# Altium project CurrentMonitorAndController.PrjPcb (part 2 of 2)

## Sheet Display.SchDoc
size A4
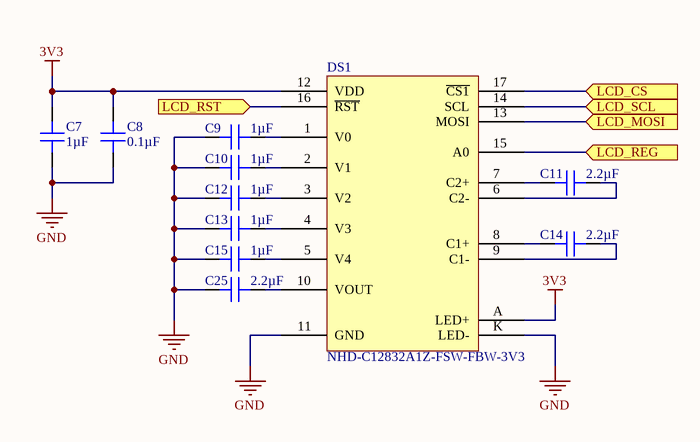
[diagram p4: Display.SchDoc]

### Parts
C7  1µF  [CAP 0603_1608]
C8  0.1µF  [CAP 0603_1608]
C9  1µF  [CAP 0603_1608]
C10  1µF  [CAP 0603_1608]
C11  2.2µF  [CAP 0603_1608]
C12  1µF  [CAP 0603_1608]
C13  1µF  [CAP 0603_1608]
C14  2.2µF  [CAP 0603_1608]
C15  1µF  [CAP 0603_1608]
C25  2.2µF  [CAP 0603_1608]
DS1  NHD-C12832A1Z-FSW-FBW-3V3  [NHD-C12832A1Z WHITE]

### Ports
LCD_CS (in), LCD_MOSI (in), LCD_REG (in), LCD_RST (in), LCD_SCL (in)

### Nets
3V3: C7.2 C8.2 DS1.12(VDD) DS1.A(LED+)
GND: C7.1 C8.1 C9.2 C10.2 C12.2 C13.2 C15.2 C25.1 DS1.11(GND) DS1.K(LED-)
LCD_CS: DS1.17(~{CS1}) ; port LCD_CS
LCD_REG: DS1.15(A0) ; port LCD_REG
LCD_RST: DS1.16(~{RST}) ; port LCD_RST
SCL: DS1.14(SCL) ; port LCD_SCL
SPI_MOSI: DS1.13(MOSI) ; port LCD_MOSI
NetC9_1: C9.1 DS1.1(V0)
NetC10_1: C10.1 DS1.2(V1)
NetC11_1: C11.1 DS1.7(C2+)
NetC11_2: C11.2 DS1.6(C2-)
NetC12_1: C12.1 DS1.3(V2)
NetC13_1: C13.1 DS1.4(V3)
NetC14_1: C14.1 DS1.8(C1+)
NetC14_2: C14.2 DS1.9(C1-)
NetC15_1: C15.1 DS1.5(V4)
NetC25_2: C25.2 DS1.10(VOUT)

### Notes on the sheet
- Title
- Size:
- Date:
- A4
- Number:
- Time:
- Revision:
- Sheet
- of
- File:

### Library data of the parts
C7 C9 C10 C12 C13 C15 = TMK107BJ105MAHT: CAP CER 1UF 25V X5R 0603; Manufacturer: Taiyo Yuden; Tolerance: ±20%; Part Number: TMK107BJ105MAHT; Value: 1µF; Applications: Automotive, SMPS Filtering; Capacitance: 1µF; ComponentLink1Description: Datasheet; ComponentLink1URL: https://ds.yuden.co.jp/TYCOMPAS/ut/detail?pn=TMK107BJ105MAHT &u=M; ComponentLink2Description: DigiKey Link; ComponentLink2URL: http://digikey.com/product-detail/en/taiyo-yuden/TMK107BJ105MAHT/587-6356-1-ND/9949942; Device Package: 0603 (1608 Metric); Features: Ultra Low ESR; LastUpdated: 02/01/2020 00:02:07; Lifecycle Status: Active; Minimum Order: 1; Mounting Type: Surface Mount, MLCC; Operating Temperature: -55°C ~ 85°C; Package / Case: 0603 (1608 Metric); Packaging: ReReel; PartId: 2797; Part Status: Active; Price: 0.00; Ratings: AEC-Q200; Series: M; Size / Dimension: 0.063" L x 0.031" W (1.60mm x 0.80mm); Supplier 1: DigiKey; Supplier Part Number 1: 587-6356-1-ND; Temperature Coefficient: X5R; Thickness (Max): 0.035" (0.90mm); Voltage - Rated: 25V
C8 = CS0603KRX7R7BB104: CAP CER 0.1UF 16V X7R 0603; Manufacturer: Yageo; Tolerance: ±10%; Part Number: CS0603KRX7R7BB104; Value: 0.1µF; Applications: Boardflex Sensitive; Capacitance: 0.1µF; ComponentLink1Description: Datasheet; ComponentLink1URL: http://www.yageo.com/NewPortal/yageodocoutput?fileName=/pdf/MLCC/UPY-ST_NPOX7R_16V-to-3KV_5.pdf; ComponentLink2Description: DigiKey Link; ComponentLink2URL: http://digikey.com/product-detail/en/yageo/CS0603KRX7R7BB104/311-3560-1-ND/7648487; Device Package: 0603 (1608 Metric); Features: Soft Termination; LastUpdated: 02/01/2020 00:02:08; Lifecycle Status: Active; Minimum Order: 1; Mounting Type: Surface Mount, MLCC; Operating Temperature: -55°C ~ 125°C; Package / Case: 0603 (1608 Metric); Packaging: ReReel; PartId: 2286; Part Status: Active; Price: 0.00; Series: CS; Size / Dimension: 0.063" L x 0.031" W (1.60mm x 0.80mm); Supplier 1: DigiKey; Supplier Part Number 1: 311-3560-1-ND; Temperature Coefficient: X7R; Thickness (Max): 0.037" (0.95mm); Voltage - Rated: 16V
C11 C14 C25 = CC0603ZRY5V7BB225: CAP CER 2.2UF 16V Y5V 0603; Manufacturer: Yageo; Temperature Coefficient: Y5V (F); Tolerance: -20%, +80%; Part Number: CC0603ZRY5V7BB225; Value: 2.2µF; Applications: General Purpose; Capacitance: 2.2µF; ComponentLink1Description: Datasheet; ComponentLink1URL: http://www.yageo.com/documents/recent/UPY-GPHC_Y5V_6.3V-to-50V_8.pdf; ComponentLink2Description: DigiKey Link; ComponentLink2URL: http://digikey.com/product-detail/en/yageo/CC0603ZRY5V7BB225/311-3416-1-ND/7164437; Device Package: 0603 (1608 Metric); LastUpdated: 21/01/2020 00:02:09; Lifecycle Status: Active; Minimum Order: 1; Mounting Type: Surface Mount, MLCC; Operating Temperature: -30°C ~ 85°C; Package / Case: 0603 (1608 Metric); Packaging: TapeAndReel; PartId: 2203; Part Status: Active; Price: 0.02; Series: CC; Size / Dimension: 0.063" L x 0.031" W (1.60mm x 0.80mm); Supplier 1: DigiKey; Supplier Part Number 1: 311-3416-1-ND; Thickness (Max): 0.035" (0.90mm); Voltage - Rated: 16V
DS1 = NHD-C12832A1Z-FSW-FBW-3V3: LCD COG GRAPHIC 128X32; Manufacturer: Newhaven Display Intl; Background Color: White (Black - Inverted); Backlight: LED - White; Display Mode: Transflective; Display Type: FSTN - Film Super-Twisted Nematic; Interface: SPI; Viewing Area: 36.00mm W x 12.00mm H; Part Number: NHD-C12832A1Z-FSW-FBW-3V3; ComponentLink1Description: Datasheet; ComponentLink1URL: http://www.newhavendisplay.com/specs/NHD-C12832A1Z-FSW-FBW-3V3.pdf; ComponentLink2Description: DigiKey Link; ComponentLink2URL: //digikey.com/product-detail/en/newhaven-display-intl/NHD-C12832A1Z-FSW-FBW-3V3/NHD-C12832A1Z-FSW-FBW-3V3-ND/2059236; LastUpdated: 04/12/2019 12:49:03; Lifecycle Status: 0; Minimum Order: 1; Packaging: Unknown; PartId: 1; Part Status: Active; Price: 11.53; Series: -; Supplier 1: DigiKey; Supplier Part Number 1: NHD-C12832A1Z-FSW-FBW-3V3-ND

## Sheet Regulator3V3.SchDoc: 3V3 Regulator
size A4
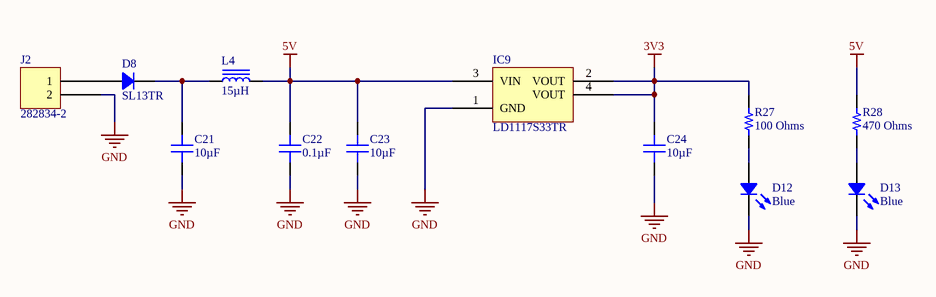
[diagram p5: Regulator3V3.SchDoc]

### Parts
C21  10µF  [CAP 1206_3216 - 1.8MM]
C22  0.1µF  [CAP 0603_1608]
C23  10µF  [CAP 1206_3216 - 1.8MM]
C24  10µF  [CAP 1206_3216 - 1.8MM]
D8  SL13TR  [DO214AC SMA]
D12  Blue  [LED 0603_1608 BLUE]
D13  Blue  [LED 0603_1608 BLUE]
IC9  LD1117S33TR  [ST SOT-223]
J2  282834-2  [TE 282834-2]
L4  15µH  [TDK VLCF4024-2]
R27  100 Ohms  [RES 0603_1608]
R28  470 Ohms  [RES 0603_1608]

### Nets
3V3: C24.2 IC9.2(VOUT) IC9.4(VOUT) R27.2
5V: C22.2 C23.2 IC9.3(VIN) L4.2 R28.2
GND: C21.1 C22.1 C23.1 C24.1 D12.2 D13.2 IC9.1(GND) J2.2
NetC21_2: C21.2 D8.2 L4.1
NetD8_1: D8.1 J2.1
NetD12_1: D12.1 R27.1
NetD13_1: D13.1 R28.1

### Notes on the sheet
- Title
- Size:
- Date:
- A4
- Number:
- Time:
- Revision:
- Sheet
- of
- File:

### Library data of the parts
C21 C23 C24 = CL31A106KPHNNNE: CAP CER 10UF 10V X5R 1206; Manufacturer: Samsung Electro-Mechanics; Tolerance: ±10%; Part Number: CL31A106KPHNNNE; Value: 10µF; Applications: General Purpose; Capacitance: 10µF; ComponentLink1Description: Datasheet; ComponentLink1URL: http://www.samsungsem.com/kr/support/product-search/mlcc/CL31A106KPHNNNE.jsp; ComponentLink2Description: DigiKey Link; ComponentLink2URL: http://digikey.com/product-detail/en/samsung-electro-mechanics/CL31A106KPHNNNE/1276-1148-1-ND/3889234; Device Package: 1206 (3216 Metric); LastUpdated: 21/01/2020 00:03:41; Lifecycle Status: Active; Minimum Order: 1; Mounting Type: Surface Mount, MLCC; Operating Temperature: -55°C ~ 85°C; Package / Case: 1206 (3216 Metric); Packaging: TapeAndReel; PartId: 21985; Part Status: Active; Price: 0.04; Series: CL; Size / Dimension: 0.126" L x 0.063" W (3.20mm x 1.60mm); Supplier 1: DigiKey; Supplier Part Number 1: 1276-1148-1-ND; Temperature Coefficient: X5R; Thickness (Max): 0.071" (1.80mm); Voltage - Rated: 10V
C22 = CS0603KRX7R7BB104: as C8 on sheet Display; Part Number: CS0603KRX7R7BB104; Value: 0.1µF; Applications: Boardflex Sensitive; Capacitance: 0.1µF; ComponentLink1Description: Datasheet; ComponentLink1URL: http://www.yageo.com/NewPortal/yageodocoutput?fileName=/pdf/MLCC/UPY-ST_NPOX7R_16V-to-3KV_5.pdf; ComponentLink2Description: DigiKey Link; ComponentLink2URL: http://digikey.com/product-detail/en/yageo/CS0603KRX7R7BB104/311-3560-1-ND/7648487; Device Package: 0603 (1608 Metric); Features: Soft Termination; LastUpdated: 02/01/2020 00:02:08; Lifecycle Status: Active; Minimum Order: 1; Mounting Type: Surface Mount, MLCC; Operating Temperature: -55°C ~ 125°C; Package / Case: 0603 (1608 Metric); Packaging: ReReel; PartId: 2286; Part Status: Active; Price: 0.00; Series: CS; Size / Dimension: 0.063" L x 0.031" W (1.60mm x 0.80mm); Supplier 1: DigiKey; Supplier Part Number 1: 311-3560-1-ND; Temperature Coefficient: X7R; Thickness (Max): 0.037" (0.95mm); Voltage - Rated: 16V
D8 = SL13TR: DIODE SCHOTTKY 30V 1A SMA; Manufacturer: SMC Diode Solutions; Current - Reverse Leakage @ Vr: 500µA @ 30V; Speed: Fast Recovery =< 500ns, > 200mA (Io); Voltage - Forward (Vf) (Max) @ If: 380mV @ 1A; Part Number: SL13TR; ComponentLink1Description: Datasheet; ComponentLink1URL: http://www.smc-diodes.com/propdf/SL12-SL14%20N0975%20REV.A.pdf; ComponentLink2Description: DigiKey Link; ComponentLink2URL: http://digikey.com/product-detail/en/smc-diode-solutions/SL13TR/1655-2289-1-ND/10384677; Current - Average Rectified (Io): 1A; Device Package: DO-214AC, SMA; Diode Type: Schottky; LastUpdated: 21/01/2020 02:41:10; Lifecycle Status: Active; Minimum Order: 1; Mounting Type: Surface Mount; Operating Temperature - Junction: -65°C ~ 125°C; Package / Case: DO-214AC, SMA; Packaging: TapeAndReel; PartId: 2188; Part Status: Active; Price: 0.06; Series: -; Supplier 1: DigiKey; Supplier Part Number 1: 1655-2289-1-ND; Supplier Device Package: SMA; Voltage - DC Reverse (Vr) (Max): 30V
D12 D13 = EAST16084BA8: LED BLUE CLEAR 2SMD; Manufacturer: Everlight Electronics Co Ltd; Configuration: Standard; Current - Test: 5mA; Lens Color: Colorless; Lens Size: 1.00mm x 0.80mm; Lens Style: Rectangle with Flat Top; Viewing Angle: 120°; Voltage - Forward (Vf) (Typ): 2.8V; Wavelength - Peak: 468nm; Part Number: EAST16084BA8; Color: Blue; ComponentLink1Description: Datasheet; ComponentLink1URL: https://everlightamericas.com/index.php?controller=attachment&id_attachment=3217; ComponentLink2Description: DigiKey Link; ComponentLink2URL: http://digikey.com/product-detail/en/everlight-electronics-co-ltd/EAST16084BA8/1080-1562-1-ND/8510390; Device Package: 0603 (1608 Metric); Height (Max): 0.50mm; LastUpdated: 21/01/2020 03:10:56; Lens Transparency: Clear; Lifecycle Status: Active; Minimum Order: 1; Mounting Type: Surface Mount; Package / Case: 0603 (1608 Metric); Packaging: TapeAndReel; PartId: 800; Part Status: Active; Price: 0.05; Series: -; Size / Dimension: 1.60mm L x 0.80mm W; Supplier 1: DigiKey; Supplier Part Number 1: 1080-1562-1-ND; Supplier Device Package: 2-SMD; Value: Blue
IC9 = LD1117S33TR: IC REG LINEAR 3.3V 800MA SOT223; Manufacturer: STMicroelectronics; Current - Quiescent (Iq): 10mA; Number of Regulators: 1; Output Configuration: Positive; Output Type: Fixed; Protection Features: Over Current, Over Temperature; PSRR: 75dB (120Hz); Voltage Dropout (Max): 1.2V @ 800mA; Voltage - Input (Max): 15V; Part Number: LD1117S33TR; ComponentLink1Description: Datasheet; ComponentLink1URL: http://www.st.com/content/ccc/resource/technical/document/datasheet/99/3b/7d/91/91/51/4b/be/CD00000544.pdf/files/CD00000544.pdf/jcr:content/translations/en.CD00000544.pdf; ComponentLink2Description: DigiKey Link; ComponentLink2URL: http://digikey.com/product-detail/en/stmicroelectronics/LD1117S33TR/497-1242-1-ND/586242; Current - Output: 800mA; Device Package: TO-261-4, TO-261AA; LastUpdated: 21/01/2020 03:56:43; Lifecycle Status: Active; Minimum Order: 1; Mounting Type: Surface Mount; Operating Temperature: 0°C ~ 125°C; Package / Case: TO-261-4, TO-261AA; Packaging: TapeAndReel; Part Status: Active; Price: 0.14; Series: -; Supplier 1: DigiKey; Supplier Part Number 1: 497-1242-1-ND; Supplier Device Package: SOT-223; Voltage - Output (Min/Fixed): 3.3V
J2 = 282834-2: TERM BLK 2P SIDE ENT 2.54MM PCB; Manufacturer: TE Connectivity AMP Connectors; Current: 10A; Mating Orientation: Horizontal with Board; Number of Levels: 1; Pitch: 0.100" (2.54mm); Positions Per Level: 2; Voltage: 150V; Wire Gauge: 16-30 AWG; Wire Termination: Screw - Rising Cage Clamp; Part Number: 282834-2; Color: Green; ComponentLink1Description: Datasheet; ComponentLink1URL: https://www.te.com/commerce/DocumentDelivery/DDEController?Action=srchrtrv&DocNm=282834&DocType=Customer+Drawing&DocLang=English; ComponentLink2Description: DigiKey Link; ComponentLink2URL: http://digikey.com/product-detail/en/te-connectivity-amp-connectors/282834-2/A98333-ND/1150135; LastUpdated: 15/01/2020 04:15:38; Lifecycle Status: Active; Minimum Order: 1; Mounting Type: Through Hole; Packaging: Bulk; Part Status: Active; Price: 0.88; Series: Buchanan; Supplier 1: DigiKey; Supplier Part Number 1: A98333-ND
L4 = VLCF4024T-150MR80-2: FIXED IND 15UH 800MA 198 MOHM; Manufacturer: TDK Corporation; DC Resistance (DCR): 198mOhm Max; Inductance Frequency - Test: 100kHz; Material - Core: Ferrite; Shielding: Shielded; Tolerance: ±20%; Type: Wirewound; Part Number: VLCF4024T-150MR80-2; ComponentLink1Description: Datasheet; ComponentLink1URL: https://product.tdk.com/info/en/catalog/datasheets/inductor_commercial_power_vlcf4024-2_en.pdf?ref_disty=digikey; ComponentLink2Description: DigiKey Link; ComponentLink2URL: http://digikey.com/product-detail/en/tdk-corporation/VLCF4024T-150MR80-2/445-8729-1-ND/3083304; Current Rating (Amps): 800mA; Current - Saturation: 800mA; Device Package: Nonstandard; Height - Seated (Max): 0.094" (2.40mm); Inductance: 15µH; LastUpdated: 21/01/2020 03:26:16; Lifecycle Status: Active; Minimum Order: 1; Mounting Type: Surface Mount; Operating Temperature: -40°C ~ 105°C; Package / Case: Nonstandard; Packaging: TapeAndReel; PartId: 163; Part Status: Active; Price: 0.44; Series: VLCF; Size / Dimension: 0.157" L x 0.157" W (4.00mm x 4.00mm); Supplier 1: DigiKey; Supplier Part Number 1: 445-8729-1-ND; Value: 15µH
R27 = ERJ-3EKF1000V: RES SMD 100 OHM 1% 1/10W 0603; Manufacturer: Panasonic Electronic Components; Power (Watts): 0.1W, 1/10W; Temperature Coefficient: ±100ppm/°C; Part Number: ERJ-3EKF1000V; Value: 100 Ohms; ComponentLink1Description: Datasheet; ComponentLink1URL: https://industrial.panasonic.com/cdbs/www-data/pdf/RDA0000/AOA0000C304.pdf; ComponentLink2Description: DigiKey Link; ComponentLink2URL: http://digikey.com/product-detail/en/panasonic-electronic-components/ERJ-3EKF1000V/P100HCT-ND/198109; Composition: Thick Film; Device Package: 0603 (1608 Metric); Features: Automotive AEC-Q200; Height - Seated (Max): 0.022" (0.55mm); LastUpdated: 21/01/2020 00:14:57; Lifecycle Status: Active; Minimum Order: 1; Number of Terminations: 2; Operating Temperature: -55°C ~ 155°C; Package / Case: 0603 (1608 Metric); Packaging: TapeAndReel; PartId: 25696; Part Status: Active; Price: 0.01; Ratings: AEC-Q200; Resistance: 100 Ohms; Series: ERJ; Size / Dimension: 0.063" L x 0.031" W (1.60mm x 0.80mm); Supplier 1: DigiKey; Supplier Part Number 1: P100HCT-ND; Supplier Device Package: 0603; Tolerance: ±1%
R28 = ERJ-3EKF4700V: RES SMD 470 OHM 1% 1/10W 0603; Manufacturer: Panasonic Electronic Components; Power (Watts): 0.1W, 1/10W; Temperature Coefficient: ±100ppm/°C; Part Number: ERJ-3EKF4700V; Value: 470 Ohms; ComponentLink1Description: Datasheet; ComponentLink1URL: https://industrial.panasonic.com/cdbs/www-data/pdf/RDA0000/AOA0000C304.pdf; ComponentLink2Description: DigiKey Link; ComponentLink2URL: http://digikey.com/product-detail/en/panasonic-electronic-components/ERJ-3EKF4700V/P470HCT-ND/1746781; Composition: Thick Film; Device Package: 0603 (1608 Metric); Features: Automotive AEC-Q200; Height - Seated (Max): 0.022" (0.55mm); LastUpdated: 21/01/2020 00:24:38; Lifecycle Status: Active; Minimum Order: 1; Number of Terminations: 2; Operating Temperature: -55°C ~ 155°C; Package / Case: 0603 (1608 Metric); Packaging: TapeAndReel; PartId: 5664; Part Status: Active; Price: 0.01; Ratings: AEC-Q200; Resistance: 470 Ohms; Series: ERJ; Size / Dimension: 0.063" L x 0.031" W (1.60mm x 0.80mm); Supplier 1: DigiKey; Supplier Part Number 1: P470HCT-ND; Supplier Device Package: 0603; Tolerance: ±1%

## Sheet OutputChannel.SchDoc: Output Channel
size A4
Used 6 times, as channels OUT1, OUT2, OUT3, OUT4, OUT5, OUT6. Parts and nets are listed once, with the designators drawn on the sheet.
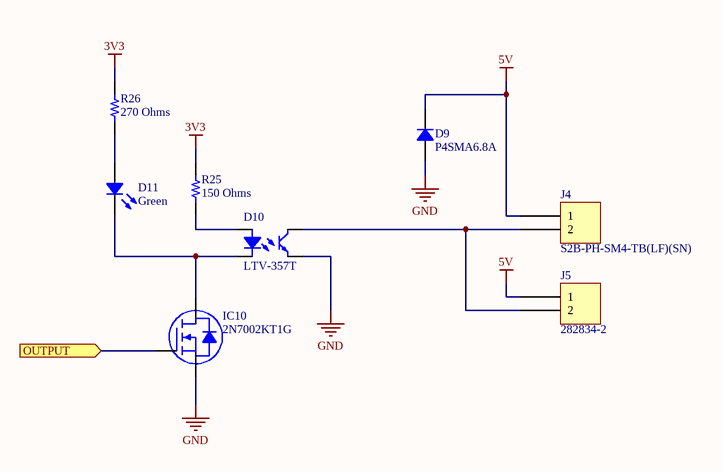
[diagram p6: OutputChannel.SchDoc]

### Parts
D9  P4SMA6.8A  [DO214AC SMA]
D10  LTV-357T  [LITEON LTV-357T]
D11  Green  [LED 0603_1608 GREEN]
IC10  2N7002KT1G  [ON SEMI SOT-23-3]
J4  S2B-PH-SM4-TB(LF)(SN)  [JST S2B-PH-SM4-TB]
J5  282834-2  [TE 282834-2]
R25  150 Ohms  [RES 0603_1608]
R26  270 Ohms  [RES 0603_1608]

### Ports
OUTPUT (in)

### Nets
3V3: R25.2 R26.2
5V: D9.2 J4.1 J5.1
GND: D9.1 D10.3 IC10.2(S)
OUTPUT: IC10.1(G) ; port OUTPUT
NetD10_1: D10.1 R25.1
NetD10_2: D10.2 D11.2 IC10.3(D)
NetD10_4: D10.4 J4.2 J5.2
NetD11_1: D11.1 R26.1

### Channels
OUT1: designators end in _OUT1; ports OUTPUT=OUT1
OUT2: designators end in _OUT2; ports OUTPUT=OUT2
OUT3: designators end in _OUT3; ports OUTPUT=OUT3
OUT4: designators end in _OUT4; ports OUTPUT=OUT4
OUT5: designators end in _OUT5; ports OUTPUT=OUT5
OUT6: designators end in _OUT6; ports OUTPUT=OUT6

### Notes on the sheet
- Title
- Size:
- Date:
- A4
- Number:
- Time:
- Revision:
- Sheet
- of
- File:

### Library data of the parts
D9 = P4SMA6.8A: TVS DIODE 5.8V 10.5V DO214AC; Manufacturer: Littelfuse Inc.; Current - Peak Pulse (10/1000µs): 39A; Power Line Protection: No; Power - Peak Pulse: 400W; Type: Zener; Unidirectional Channels: 1; Voltage - Breakdown (Min): 6.45V; Part Number: P4SMA6.8A; Applications: General Purpose; ComponentLink1Description: Datasheet; ComponentLink1URL: https://www.littelfuse.com/~/media/electronics/datasheets/tvs_diodes/littelfuse_tvs_diode_p4sma_datasheet.pdf.pdf; ComponentLink2Description: DigiKey Link; ComponentLink2URL: http://digikey.com/product-detail/en/littelfuse-inc/P4SMA6.8A/F5656CT-ND/3307038; Device Package: DO-214AC, SMA; LastUpdated: 21/01/2020 03:10:24; Lifecycle Status: Active; Minimum Order: 1; Mounting Type: Surface Mount; Operating Temperature: -65°C ~ 150°C (TJ); Package / Case: DO-214AC, SMA; Packaging: TapeAndReel; PartId: 395; Part Status: Active; Price: 0.13; Series: P4SMA; Supplier 1: DigiKey; Supplier Part Number 1: F5656CT-ND; Supplier Device Package: DO-214AC (SMA); Voltage - Clamping (Max) @ Ipp: 10.5V; Voltage - Reverse Standoff (Typ): 5.8V
D10 = LTV-357T: OPTOISOLATOR 3.75KV TRANS 4-SOP; Manufacturer: Lite-On Inc.; Current - DC Forward (If) (Max): 50mA; Current Transfer Ratio (Max): 600% @ 5mA; Current Transfer Ratio (Min): 50% @ 5mA; Input Type: DC; Number of Channels: 1; Output Type: Transistor; Rise / Fall Time (Typ): 4µs, 3µs; Vce Saturation (Max): 200mV; Voltage - Forward (Vf) (Typ): 1.2V; Voltage - Isolation: 3750Vrms; Voltage - Output (Max): 35V; Part Number: LTV-357T; ComponentLink1Description: Datasheet; ComponentLink1URL: http://optoelectronics.liteon.com/upload/download/DS70-2001-012/LTV-357T%20series%20201606.pdf; ComponentLink2Description: DigiKey Link; ComponentLink2URL: http://digikey.com/product-detail/en/lite-on-inc/LTV-357T/160-1339-1-ND/385809; Current - Output / Channel: 50mA; Device Package: 4-SMD, Gull Wing; LastUpdated: 12/01/2020 21:57:43; Lifecycle Status: Active; Minimum Order: 1; Mounting Type: Surface Mount; Operating Temperature: -55°C ~ 110°C; Package / Case: 4-SMD, Gull Wing; Packaging: TapeAndReel; Part Status: Active; Price: 0.12; Series: -; Supplier 1: DigiKey; Supplier Part Number 1: 160-1339-1-ND; Supplier Device Package: 4-SOP
D11 = LTST-C190KGKT: LED GREEN CLEAR CHIP SMD; Manufacturer: Lite-On Inc.; Configuration: Standard; Current - Test: 20mA; Lens Color: Colorless; Lens Size: 1.10mm x 0.80mm; Lens Style: Rectangle with Flat Top; Millicandela Rating: 35mcd; Viewing Angle: 130°; Voltage - Forward (Vf) (Typ): 2V; Wavelength - Dominant: 571nm; Wavelength - Peak: 574nm; Part Number: LTST-C190KGKT; Color: Green; ComponentLink1Description: Datasheet; ComponentLink1URL: http://optoelectronics.liteon.com/upload/download/DS22-2000-074/LTST-C190KGKT.PDF; ComponentLink2Description: DigiKey Link; ComponentLink2URL: http://digikey.com/product-detail/en/lite-on-inc/LTST-C190KGKT/160-1435-1-ND/386814; Device Package: 0603 (1608 Metric); Height (Max): 0.90mm; LastUpdated: 21/01/2020 03:12:09; Lens Transparency: Clear; Lifecycle Status: Active; Minimum Order: 1; Mounting Type: Surface Mount; Package / Case: 0603 (1608 Metric); Packaging: TapeAndReel; PartId: 657; Part Status: Active; Price: 0.04; Series: -; Size / Dimension: 1.60mm L x 0.80mm W; Supplier 1: DigiKey; Supplier Part Number 1: 160-1435-1-ND; Supplier Device Package: Chip LED; Value: Green
IC10 = 2N7002KT1G: MOSFET N-CH 60V 320MA SOT-23; Manufacturer: ON Semiconductor; Current - Continuous Drain (Id) @ 25°C: 320mA (Ta); Drive Voltage (Max Rds On,  Min Rds On): 4.5V, 10V; FET Type: N-Channel; Gate Charge (Qg) (Max) @ Vgs: 0.7nC @ 4.5V; Input Capacitance (Ciss) (Max) @ Vds: 24.5pF @ 20V; Power Dissipation (Max): 350mW (Ta); Rds On (Max) @ Id, Vgs: 1.6Ohm @ 500mA, 10V; Vgs (Max): ±20V; Vgs(th) (Max) @ Id: 2.5V @ 250µA; Part Number: 2N7002KT1G; ComponentLink1Description: Datasheet; ComponentLink1URL: http://www.onsemi.com/pub/Collateral/2N7002K-D.PDF; ComponentLink2Description: DigiKey Link; ComponentLink2URL: http://digikey.com/product-detail/en/on-semiconductor/2N7002KT1G/2N7002KT1GOSCT-ND/1967030; Device Package: TO-236-3, SC-59, SOT-23-3; Drain to Source Voltage (Vdss): 60V; LastUpdated: 21/01/2020 04:01:12; Lifecycle Status: Active; Minimum Order: 1; Mounting Type: Surface Mount; Operating Temperature: -55°C ~ 150°C (TJ); Package / Case: TO-236-3, SC-59, SOT-23-3; Packaging: TapeAndReel; Part Status: Active; Price: 0.03; Series: -; Supplier 1: DigiKey; Supplier Part Number 1: 2N7002KT1GOSCT-ND; Supplier Device Package: SOT-23-3 (TO-236); Technology: MOSFET (Metal Oxide)
J4 = S2B-PH-SM4-TB(LF)(SN): CONN HEADER SMD R/A 2POS 2MM; Manufacturer: JST Sales America Inc.; Contact Length - Mating: 0.130" (3.30mm); Current Rating (Amps): 2A; Material Flammability Rating: UL94 V-0; Number of Positions: 2; Number of Positions Loaded: All; Pitch - Mating: 0.079" (2.00mm); Shrouding: Shrouded - 4 Wall; Style: Board to Cable/Wire; Voltage Rating: 100V; Part Number: S2B-PH-SM4-TB(LF)(SN); ComponentLink1Description: Datasheet; ComponentLink1URL: http://www.jst-mfg.com/product/pdf/eng/ePH.pdf; ComponentLink2Description: DigiKey Link; ComponentLink2URL: http://digikey.com/product-detail/en/jst-sales-america-inc/S2B-PH-SM4-TB-LF-SN/455-1749-1-ND/926846; Connector Type: Header; Contact Finish - Mating: Tin; Contact Finish - Post: Tin; Contact Material: Copper Alloy; Contact Shape: Square; Contact Type: Male Pin; Fastening Type: Detent Lock; Features: Solder Retention; Insulation Color: Natural; Insulation Height: 0.217" (5.51mm); Insulation Material: Polyamide (PA6T), Nylon 6T; LastUpdated: 15/01/2020 03:45:11; Lifecycle Status: Active; Minimum Order: 1; Mounting Type: Surface Mount, Right Angle; Number of Rows: 1; Operating Temperature: -25°C ~ 85°C; Packaging: TapeAndReel; PartId: 115; Part Status: Active; Price: 0.27; Series: PH; Supplier 1: DigiKey; Supplier Part Number 1: 455-1749-1-ND; Termination: Solder
J5 = 282834-2: as J2 on sheet Regulator3V3; Part Number: 282834-2; Color: Green; ComponentLink1Description: Datasheet; ComponentLink1URL: https://www.te.com/commerce/DocumentDelivery/DDEController?Action=srchrtrv&DocNm=282834&DocType=Customer+Drawing&DocLang=English; ComponentLink2Description: DigiKey Link; ComponentLink2URL: http://digikey.com/product-detail/en/te-connectivity-amp-connectors/282834-2/A98333-ND/1150135; LastUpdated: 15/01/2020 04:15:38; Lifecycle Status: Active; Minimum Order: 1; Mounting Type: Through Hole; Packaging: Bulk; Part Status: Active; Price: 0.88; Series: Buchanan; Supplier 1: DigiKey; Supplier Part Number 1: A98333-ND
R25 = ERJ-3EKF1500V: RES SMD 150 OHM 1% 1/10W 0603; Manufacturer: Panasonic Electronic Components; Power (Watts): 0.1W, 1/10W; Temperature Coefficient: ±100ppm/°C; Part Number: ERJ-3EKF1500V; Value: 150 Ohms; ComponentLink1Description: Datasheet; ComponentLink1URL: https://industrial.panasonic.com/cdbs/www-data/pdf/RDA0000/AOA0000C304.pdf; ComponentLink2Description: DigiKey Link; ComponentLink2URL: http://digikey.com/product-detail/en/panasonic-electronic-components/ERJ-3EKF1500V/P150HCT-ND/198177; Composition: Thick Film; Device Package: 0603 (1608 Metric); Features: Automotive AEC-Q200; Height - Seated (Max): 0.022" (0.55mm); LastUpdated: 21/01/2020 00:17:12; Lifecycle Status: Active; Minimum Order: 1; Number of Terminations: 2; Operating Temperature: -55°C ~ 155°C; Package / Case: 0603 (1608 Metric); Packaging: TapeAndReel; PartId: 23070; Part Status: Active; Price: 0.01; Ratings: AEC-Q200; Resistance: 150 Ohms; Series: ERJ; Size / Dimension: 0.063" L x 0.031" W (1.60mm x 0.80mm); Supplier 1: DigiKey; Supplier Part Number 1: P150HCT-ND; Supplier Device Package: 0603; Tolerance: ±1%
R26 = ERJ-3EKF2700V: RES SMD 270 OHM 1% 1/10W 0603; Manufacturer: Panasonic Electronic Components; Power (Watts): 0.1W, 1/10W; Temperature Coefficient: ±100ppm/°C; Part Number: ERJ-3EKF2700V; Value: 270 Ohms; ComponentLink1Description: Datasheet; ComponentLink1URL: https://industrial.panasonic.com/cdbs/www-data/pdf/RDA0000/AOA0000C304.pdf; ComponentLink2Description: DigiKey Link; ComponentLink2URL: http://digikey.com/product-detail/en/panasonic-electronic-components/ERJ-3EKF2700V/P270HCT-ND/1746751; Composition: Thick Film; Device Package: 0603 (1608 Metric); Features: Automotive AEC-Q200; Height - Seated (Max): 0.022" (0.55mm); LastUpdated: 21/01/2020 00:17:12; Lifecycle Status: Active; Minimum Order: 1; Number of Terminations: 2; Operating Temperature: -55°C ~ 155°C; Package / Case: 0603 (1608 Metric); Packaging: TapeAndReel; PartId: 23153; Part Status: Active; Price: 0.01; Ratings: AEC-Q200; Resistance: 270 Ohms; Series: ERJ; Size / Dimension: 0.063" L x 0.031" W (1.60mm x 0.80mm); Supplier 1: DigiKey; Supplier Part Number 1: P270HCT-ND; Supplier Device Package: 0603; Tolerance: ±1%

## Nets that join several sheets
3V3: CS1 (C3_CS1.2 IC1_CS1.8), CS2 (C3_CS2.2 IC1_CS2.8), CS3 (C3_CS3.2 IC1_CS3.8), CS4 (C3_CS4.2 IC1_CS4.8), CS5 (C3_CS5.2 IC1_CS5.8), 15ACurrentSensor (C4.2 IC2.8), Microcontroller (8 pins), Display (C7.2 C8.2 DS1.12 DS1.A), Regulator3V3 (C24.2 IC9.2 IC9.4 R27.2), OUT1 (R25_OUT1.2 R26_OUT1.2), OUT2 (R25_OUT2.2 R26_OUT2.2), OUT3 (R25_OUT3.2 R26_OUT3.2), OUT4 (R25_OUT4.2 R26_OUT4.2), OUT5 (R25_OUT5.2 R26_OUT5.2), OUT6 (R25_OUT6.2 R26_OUT6.2)
5V: Microcontroller (D7.2 IC7.4), Regulator3V3 (5 pins), OUT1 (D9_OUT1.2 J4_OUT1.1 J5_OUT1.1), OUT2 (D9_OUT2.2 J4_OUT2.1 J5_OUT2.1), OUT3 (D9_OUT3.2 J4_OUT3.1 J5_OUT3.1), OUT4 (D9_OUT4.2 J4_OUT4.1 J5_OUT4.1), OUT5 (D9_OUT5.2 J4_OUT5.1 J5_OUT5.1), OUT6 (D9_OUT6.2 J4_OUT6.1 J5_OUT6.1)
GND: CS1 (8 pins), CS2 (8 pins), CS3 (8 pins), CS4 (8 pins), CS5 (8 pins), 15ACurrentSensor (8 pins), Microcontroller (21 pins), Display (10 pins), Regulator3V3 (8 pins), OUT1 (D9_OUT1.1 D10_OUT1.3 IC10_OUT1.2), OUT2 (D9_OUT2.1 D10_OUT2.3 IC10_OUT2.2), OUT3 (D9_OUT3.1 D10_OUT3.3 IC10_OUT3.2), OUT4 (D9_OUT4.1 D10_OUT4.3 IC10_OUT4.2), OUT5 (D9_OUT5.1 D10_OUT5.3 IC10_OUT5.2), OUT6 (D9_OUT6.1 D10_OUT6.3 IC10_OUT6.2)
ADC0: 15ACurrentSensor (C2.2 R7.2), Microcontroller (IC6.30)
ADC1: CS1 (C1_CS1.2 R1_CS1.2), Microcontroller (IC6.32)
ADC2: CS2 (C1_CS2.2 R1_CS2.2), Microcontroller (IC6.33)
ADC3: CS3 (C1_CS3.2 R1_CS3.2), Microcontroller (IC6.34)
ADC4: CS4 (C1_CS4.2 R1_CS4.2), Microcontroller (IC6.35)
ADC5: CS5 (C1_CS5.2 R1_CS5.2), Microcontroller (IC6.40)
LCD_CS: Microcontroller (IC6.26), Display (DS1.17)
LCD_REG: Microcontroller (IC6.23), Display (DS1.15)
LCD_RST: Microcontroller (IC6.24), Display (DS1.16)
OUT1: Microcontroller (IC6.2), OUT1 (IC10_OUT1.1)
OUT2: Microcontroller (IC6.1), OUT2 (IC10_OUT2.1)
OUT3: Microcontroller (IC6.48), OUT3 (IC10_OUT3.1)
OUT4: Microcontroller (IC6.47), OUT4 (IC10_OUT4.1)
OUT5: Microcontroller (IC6.46), OUT5 (IC10_OUT5.1)
OUT6: Microcontroller (IC6.45), OUT6 (IC10_OUT6.1)
SCL: Microcontroller (IC6.29 J3.9), Display (DS1.14)
SPI_MOSI: Microcontroller (IC6.28), Display (DS1.13)